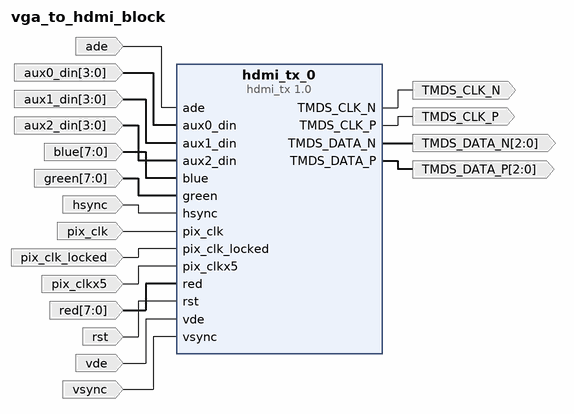
[diagram p0: block diagram of the top level]
# Vivado block design vga_to_hdmi_block, xc7s50csga324-1, Vivado 2022.2
create_bd_design vga_to_hdmi_block

create_bd_port -dir I -type clk pix_clk
set_property -dict {CONFIG.FREQ_HZ 25000000} [get_bd_ports pix_clk]
create_bd_port -dir I -type clk pix_clkx5
set_property -dict {CONFIG.FREQ_HZ 125000000} [get_bd_ports pix_clkx5]
create_bd_port -dir I pix_clk_locked
create_bd_port -dir I -type rst rst
create_bd_port -dir I -from 7 -to 0 red
create_bd_port -dir I -from 7 -to 0 green
create_bd_port -dir I -from 7 -to 0 blue
create_bd_port -dir I hsync
create_bd_port -dir I vsync
create_bd_port -dir I vde
create_bd_port -dir I -from 3 -to 0 aux0_din
create_bd_port -dir I -from 3 -to 0 aux1_din
create_bd_port -dir I -from 3 -to 0 aux2_din
create_bd_port -dir I ade
create_bd_port -dir O -type clk TMDS_CLK_P
create_bd_port -dir O -type clk TMDS_CLK_N
create_bd_port -dir O -from 2 -to 0 TMDS_DATA_N
create_bd_port -dir O -from 2 -to 0 TMDS_DATA_P

create_bd_cell -type ip -vlnv realdigital.org:realdigital:hdmi_tx:1.0 hdmi_tx_0
set_property -dict {CONFIG.MODE HDMI} [get_bd_cells hdmi_tx_0]

# ---- connections ----

connect_bd_net [get_bd_ports ade] [get_bd_pins hdmi_tx_0/ade]
connect_bd_net [get_bd_ports aux0_din] [get_bd_pins hdmi_tx_0/aux0_din]
connect_bd_net [get_bd_ports aux1_din] [get_bd_pins hdmi_tx_0/aux1_din]
connect_bd_net [get_bd_ports aux2_din] [get_bd_pins hdmi_tx_0/aux2_din]
connect_bd_net [get_bd_ports blue] [get_bd_pins hdmi_tx_0/blue]
connect_bd_net [get_bd_ports green] [get_bd_pins hdmi_tx_0/green]
connect_bd_net [get_bd_pins hdmi_tx_0/TMDS_CLK_N] [get_bd_ports TMDS_CLK_N]
connect_bd_net [get_bd_pins hdmi_tx_0/TMDS_CLK_P] [get_bd_ports TMDS_CLK_P]
connect_bd_net [get_bd_pins hdmi_tx_0/TMDS_DATA_N] [get_bd_ports TMDS_DATA_N]
connect_bd_net [get_bd_pins hdmi_tx_0/TMDS_DATA_P] [get_bd_ports TMDS_DATA_P]
connect_bd_net [get_bd_ports hsync] [get_bd_pins hdmi_tx_0/hsync]
connect_bd_net [get_bd_ports pix_clk] [get_bd_pins hdmi_tx_0/pix_clk]
connect_bd_net [get_bd_ports pix_clk_locked] [get_bd_pins hdmi_tx_0/pix_clk_locked]
connect_bd_net -net pix_clkx5_1 [get_bd_ports pix_clkx5] [get_bd_pins hdmi_tx_0/pix_clkx5]
connect_bd_net [get_bd_ports red] [get_bd_pins hdmi_tx_0/red]
connect_bd_net [get_bd_ports rst] [get_bd_pins hdmi_tx_0/rst]
connect_bd_net [get_bd_ports vde] [get_bd_pins hdmi_tx_0/vde]
connect_bd_net [get_bd_ports vsync] [get_bd_pins hdmi_tx_0/vsync]

validate_bd_design
save_bd_design
